# EAGLE design isp atmega40pin (EAGLE 6.1)
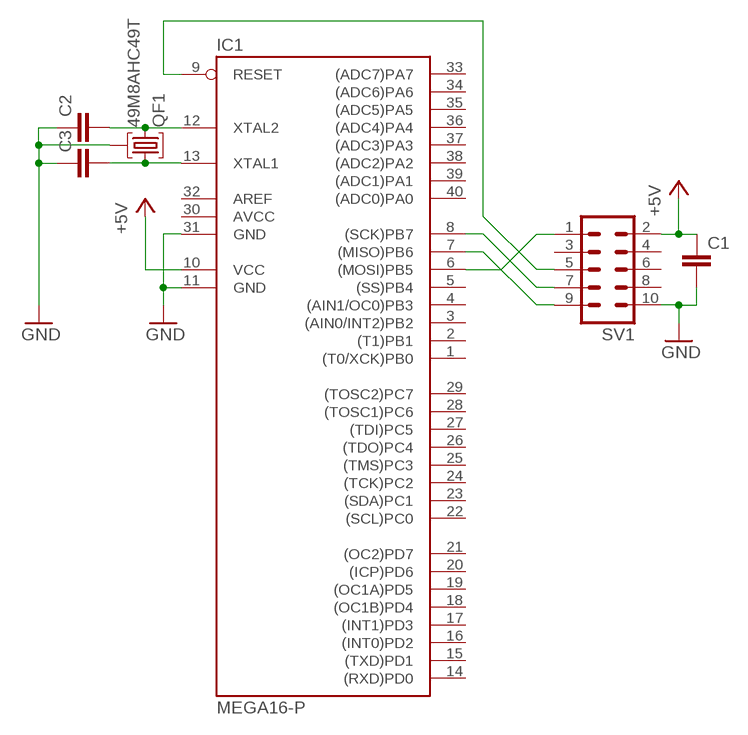
[diagram p0: schematic, sheet 1]

## Parts
C1  C-EU025-025X050  [C025-025X050]
C2  C-EU025-025X050  [C025-025X050]
C3  C-EU025-025X050  [C025-025X050]
IC1  MEGA16-P  [DIL40]
QF1  49M8AHC49T  [HC49U]
SV1  ML10  [ML10]

## Nets
+5V: C1.1 IC1.10(VCC) SV1.2
GND: C1.2 C2.1 C3.1 IC1.11(GND) IC1.31(GND) QF1.2 SV1.10
N$1: IC1.6((MOSI)PB5) SV1.1
N$3: C2.2 IC1.12(XTAL2) QF1.3
N$4: IC1.9(RESET) SV1.5
N$5: IC1.8((SCK)PB7) SV1.7
N$6: C3.2 IC1.13(XTAL1) QF1.1
N$7: IC1.7((MISO)PB6) SV1.9
Unconnected: IC1.1((T0/XCK)PB0) IC1.2((T1)PB1) IC1.3((AIN0/INT2)PB2) IC1.4((AIN1/OC0)PB3) IC1.5((SS)PB4) IC1.14((RXD)PD0) IC1.15((TXD)PD1) IC1.16((INT0)PD2) IC1.17((INT1)PD3) IC1.18((OC1B)PD4) IC1.19((OC1A)PD5) IC1.20((ICP)PD6) IC1.21((OC2)PD7) IC1.22((SCL)PC0) IC1.23((SDA)PC1) IC1.24((TCK)PC2) IC1.25((TMS)PC3) IC1.26((TDO)PC4) IC1.27((TDI)PC5) IC1.28((TOSC1)PC6) IC1.29((TOSC2)PC7) IC1.32(AREF) IC1.33((ADC7)PA7) IC1.34((ADC6)PA6) IC1.35((ADC5)PA5) IC1.36((ADC4)PA4) IC1.37((ADC3)PA3) IC1.38((ADC2)PA2) IC1.39((ADC1)PA1) IC1.40((ADC0)PA0) SV1.3 SV1.4 SV1.6 SV1.8

## Power pins joined to a net without a drawn wire
AVCC: IC1.30(AVCC)

## Library data of the parts
C1-C3 = rcl:C-EU: CAPACITOR, European symbol
IC1 = atmel:MEGA16-P: MICROCONTROLLER 16 Kbytes FLASH 1 kbytes SRAM 512 bytes EEPROM USART 8-channel 10 bit ADC Source: avr.lbr; MPN: ATMEGA16-16PU; OC_FARNELL: 9171142; OC_NEWARK: 01M6885
QF1 = crystal:49M8AHC49T: Monolithic Crystal Filters Source: www.vanlong.com; OC_FARNELL: unknown; OC_NEWARK: unknown
SV1 = con-harting-ml:ML10: HARTING; OC_FARNELL: unknown; OC_NEWARK: unknown

## Board
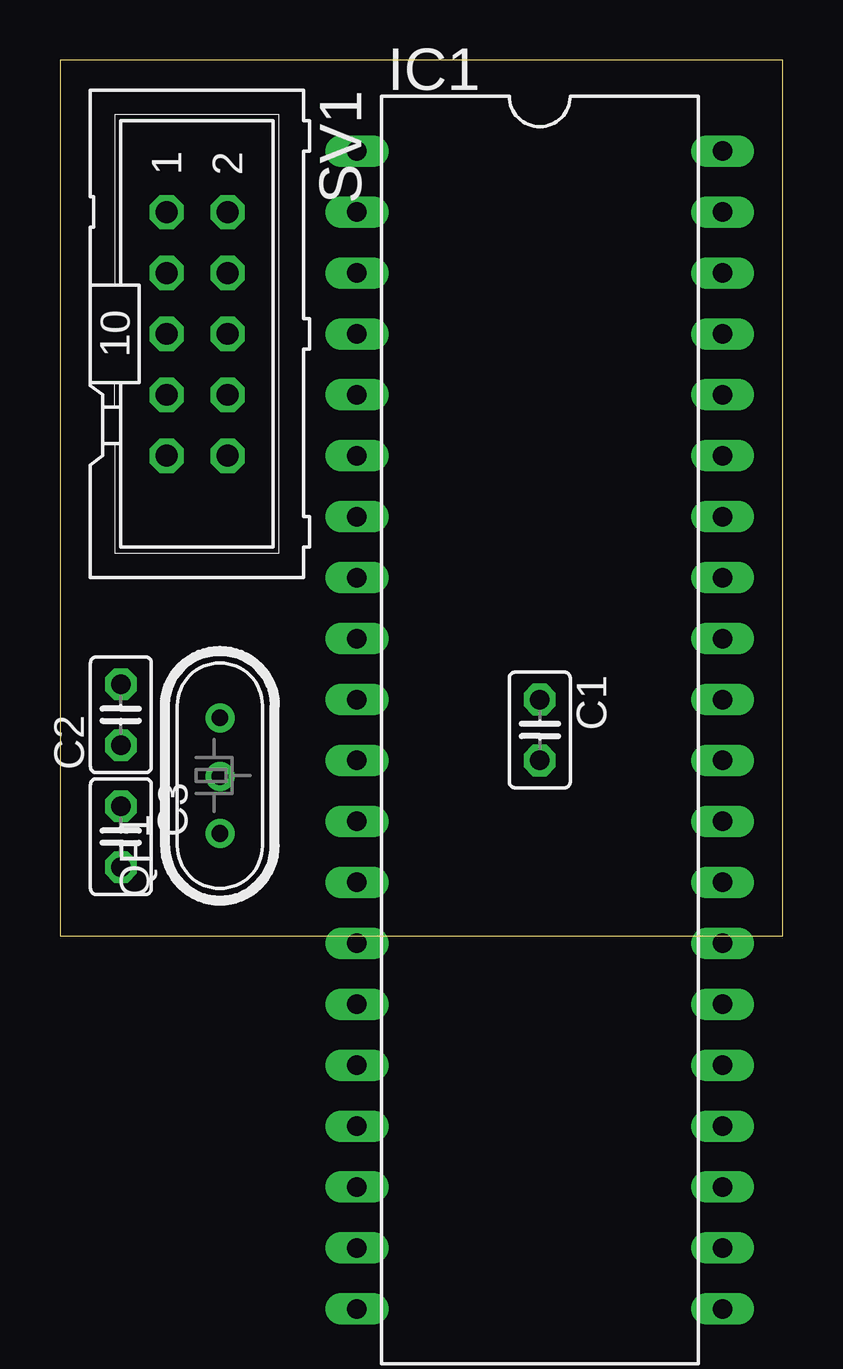
[diagram p1: board, top side]
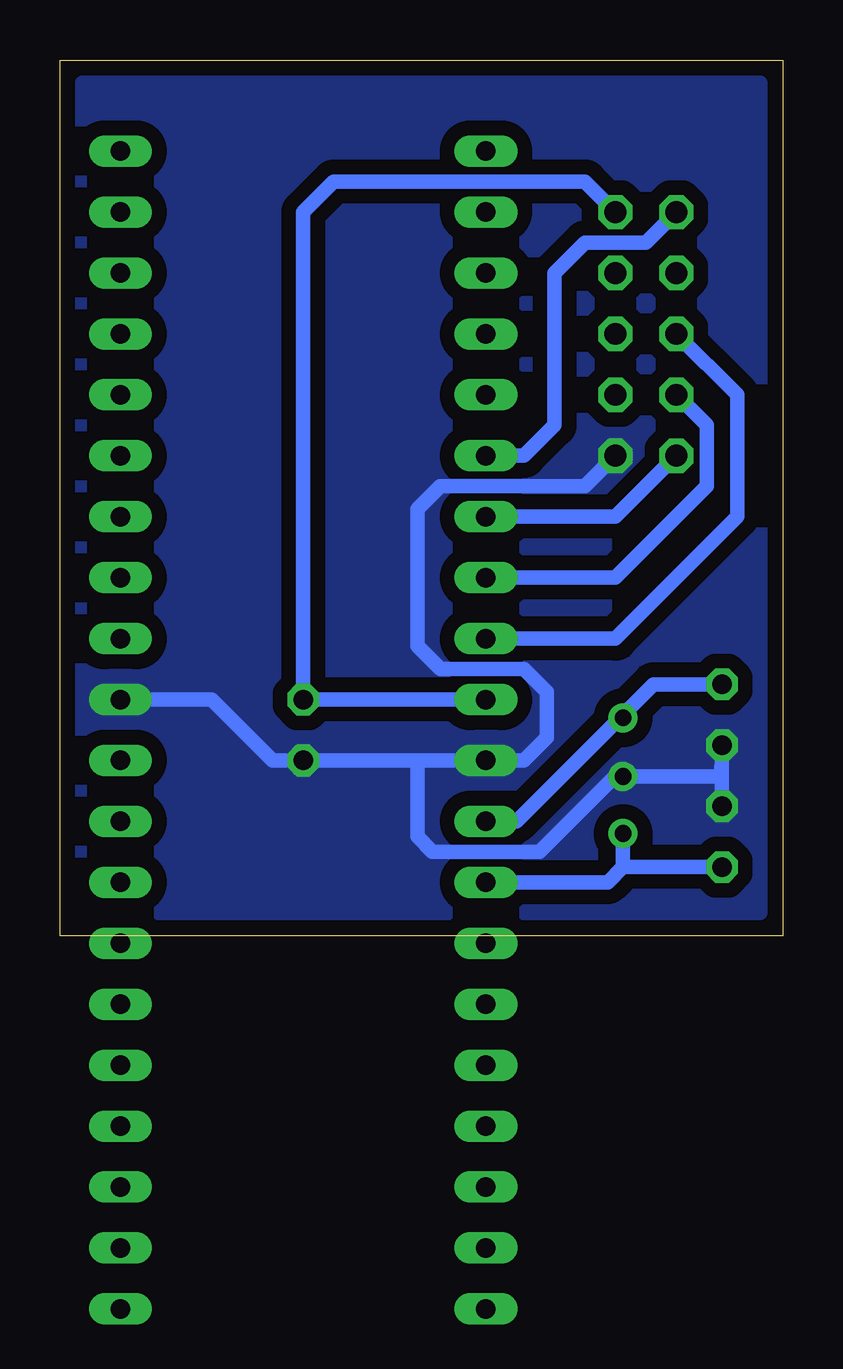
[diagram p2: board, bottom side, seen from below]

Size 30.14 x 36.5 mm. Coordinates in mm from the lower left corner, seen from the top.
Outline: 0,0 30.14,0 30.14,36.5 0,36.5 0,0
Copper layers (1*16): Top 0.035mm / dielectric 1.5mm / Bottom 0.035mm
Design rules: minimum track width 10mil, minimum drill 24mil, track to track 12mil, track to pad 12mil, pad to pad 12mil, via to via 12mil, smd to smd 10mil, copper to edge 12mil, drill to drill 12mil, minimum pad ring 10mil, minimum via ring 10mil, stop-mask expansion 4mil, vias tented up to drill 0mil, thermal gap 12mil

### Footprints (pad centres in the part's own frame; a part is rotated, then mirrored left to right if it is on the bottom)
C025-025X050 = drill 0.813 octagon: 1 -1.27,0; 2 1.27,0
DIL40 = drill 0.813 long: 1 -24.13,-7.62; 2 -21.59,-7.62; 3 -19.05,-7.62; 4 -16.51,-7.62; 5 -13.97,-7.62; 6 -11.43,-7.62; 7 -8.89,-7.62; 8 -6.35,-7.62; 9 -3.81,-7.62; 10 -1.27,-7.62; 11 1.27,-7.62; 12 3.81,-7.62; 13 6.35,-7.62; 14 8.89,-7.62; 15 11.43,-7.62; 16 13.97,-7.62; 17 16.51,-7.62; 18 19.05,-7.62; 19 21.59,-7.62; 20 24.13,-7.62; 21 24.13,7.62; 22 21.59,7.62; 23 19.05,7.62; 24 16.51,7.62; 25 13.97,7.62; 26 11.43,7.62; 27 8.89,7.62; 28 6.35,7.62; 29 3.81,7.62; 30 1.27,7.62; 31 -1.27,7.62; 32 -3.81,7.62; 33 -6.35,7.62; 34 -8.89,7.62; 35 -11.43,7.62; 36 -13.97,7.62; 37 -16.51,7.62; 38 -19.05,7.62; 39 -21.59,7.62; 40 -24.13,7.62
HC49U = drill 0.7 pad 1.2: 1 -2.413,0; 2 -0.027,0; 3 2.413,0
ML10 = drill 0.914 octagon: 1 -5.08,-1.27; 2 -5.08,1.27; 3 -2.54,-1.27; 4 -2.54,1.27; 5 0,-1.27; 6 0,1.27; 7 2.54,-1.27; 8 2.54,1.27; 9 5.08,-1.27; 10 5.08,1.27

### Placement (x,y rotation side)
C1  20,8.57 270 top
C2  2.54,9.21 90 top
C3  2.54,4.13 270 top
IC1  20,8.57 270 top
QF1  6.67,6.67 90 top
SV1  5.71,25.08 270 top

### Tracks (layer width: path | path; a pad name or v marks a point on that pad's centre or on a via)
+5V
  Bottom 0.61: IC1.10 C1.1 20,30.16 18.73,31.43 8.26,31.43 SV1.2
GND
  Bottom 0.61: IC1.31 23.81,9.84 21.27,7.3 C1.2 15.24,7.3 | SV1.10 8.26,18.73 14.29,18.73 15.24,17.78 15.24,12.06 14.29,11.11 10.79,11.11 9.84,10.16 9.84,8.26 10.79,7.3 IC1.11 15.24,7.3 | C2.1 2.54,7.62 | 2.54,7.62 C3.1 | 2.54,7.62 2.57,6.64 QF1.2 7.01,6.64 10.16,3.49 14.61,3.49 15.24,4.13 15.24,7.3
  pour Bottom (isolate 0.61, no thermals): 0.95,35.56 29.21,35.56 29.21,0.95 0.95,0.95
N$1
  Bottom 0.61: SV1.1 5.71,28.89 8.26,28.89 9.53,27.62 9.53,21.27 10.79,20 IC1.6
N$3
  Bottom 0.61: C2.2 5.4,10.48 6.67,9.21 | IC1.12 11.11,4.76 6.83,9.05 6.67,9.21 | QF1.3 6.67,9.21
N$4
  Bottom 0.61: IC1.9 6.99,12.38 1.91,17.46 1.91,22.54 SV1.5
N$5
  Bottom 0.61: SV1.7 3.17,21.27 3.17,18.73 6.99,14.92 IC1.8
N$6
  Bottom 0.61: C3.2 6.67,2.86 | 6.67,2.86 7.3,2.22 IC1.13 | QF1.1 6.67,2.86
N$7
  Bottom 0.61: SV1.9 6.99,17.46 IC1.7